# Altium schematic sheet BrauV2_Relay.SchDoc
size A3; PageSetup: Record=PageOptions|CenterHorizontal=True|CenterVertical=True|PrintScale=1.01|XCorrection=1.00|YCorrection=1.00|PrintKind=1|BorderSize=5000000|LeftOffset=0|BottomOffset=0|Orientation=2|PaperLength=1000|PaperWidth=1000|Scale=100|PaperSource=7|PrintQuality=-4|MediaType=1|DitherType=10|PaperKind=A3|PrintScaleMode=1
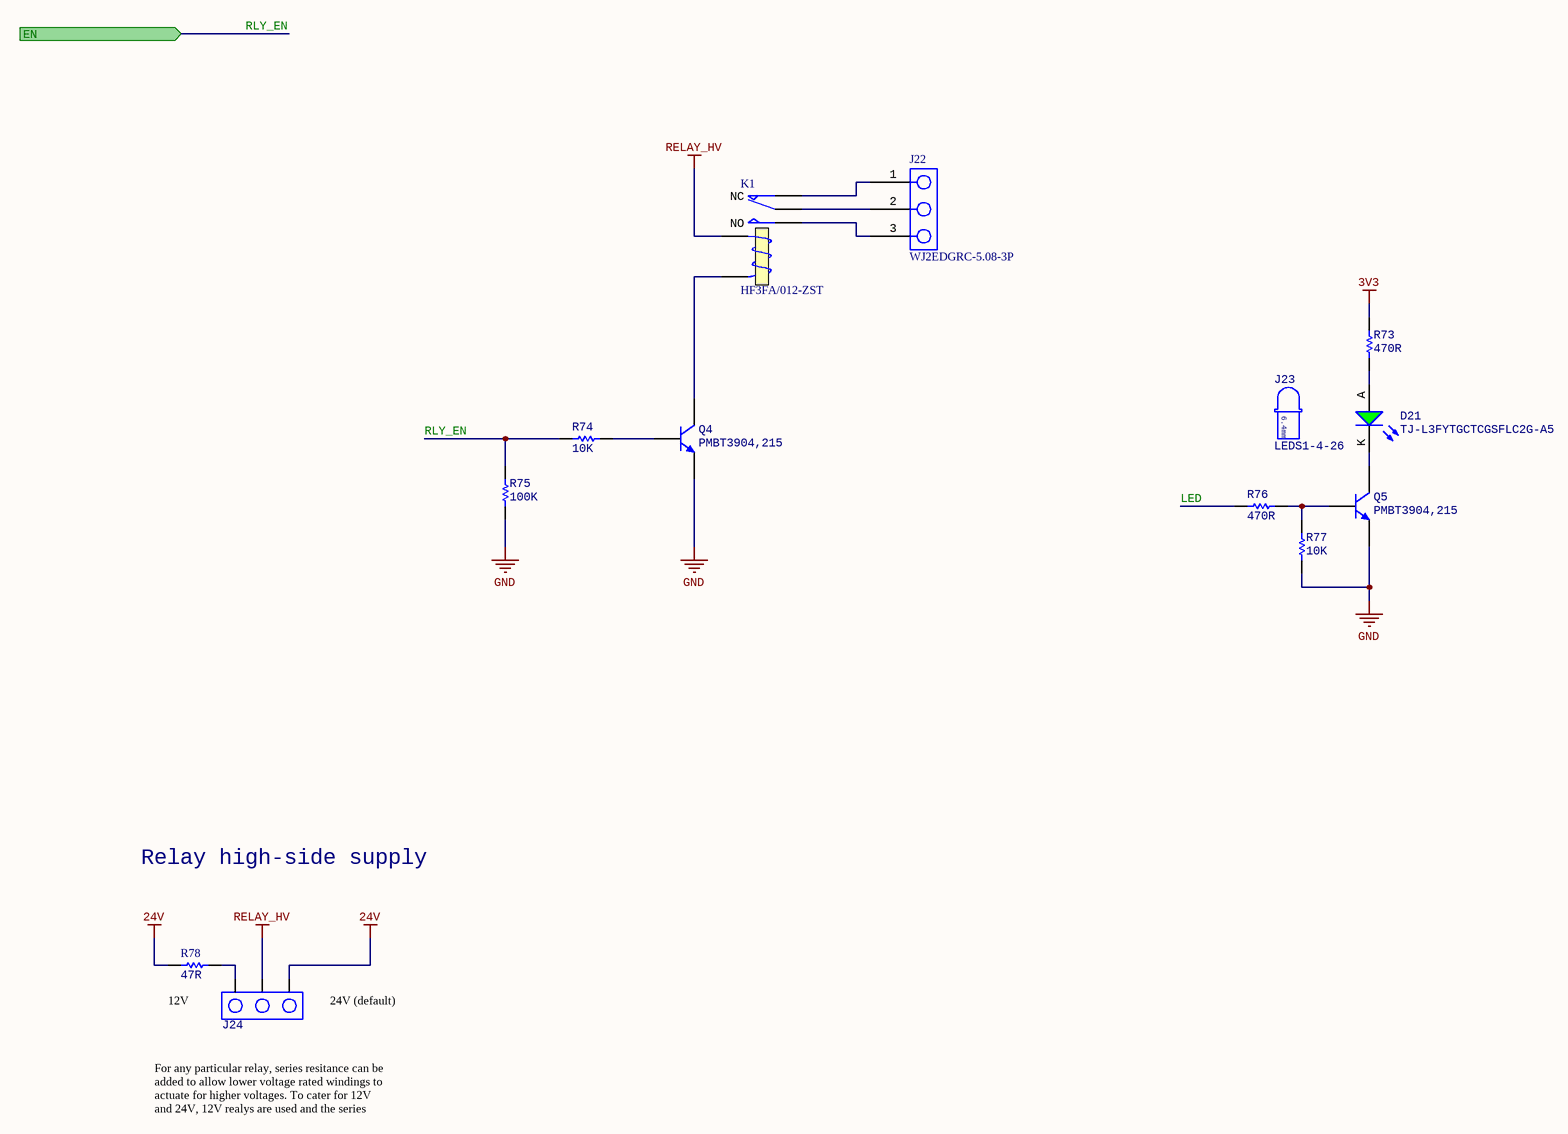
[diagram p0: BrauV2_Relay.SchDoc]

## Parts
D21  TJ-L3FYTGCTCGSFLC2G-A5  [LED_3MM_SPACED_6.4MM_GREEN]
J22  WJ2EDGRC-5.08-3P  [796638-3]
J23  LEDS1-4-26  [3MM_LED_SPACER_6.4MM]
J24  12251103CNG0S115001  [Header_3POS]  (value not drawn)
K1  HF3FA/012-ZST  [HF3FA/012-ZST]
Q4  PMBT3904,215  [SOT23-3]
Q5  PMBT3904,215  [SOT23-3]
R73  Resistance: 470R  [SMD_RES_2512(6432)_N]  (hidden comment: AC2512FK-07470RL)
R74  Resistance: 10K  [SMD_RES_0402(1005)_N]  (hidden comment: RC0402FR-0710KL)
R75  Resistance: 100K  [SMD_RES_0402(1005)_N]  (hidden comment: RC0402FR-07100KL)
R76  Resistance: 470R  [SMD_RES_2512(6432)_N]  (hidden comment: AC2512FK-07470RL)
R77  Resistance: 10K  [SMD_RES_0402(1005)_N]  (hidden comment: RC0402FR-0710KL)
R78  Resistance: 47R  [SMD_RES_2512(6432)_N]  (hidden comment: AC2512FK-0747RL)

## Ports
EN (in)

## Nets
3V3: R73.2
24V: J24.1 R78.1
GND: Q4.2(E) Q5.2(E) R75.2 R77.1
RELAY_HV: J24.2 K1.4(T1)
LED: R76.2
RLY_EN: R74.2 R75.1 ; port EN
NetD21_A: D21.A R73.1
NetD21_K: D21.K Q5.3(C)
NetJ22_1: J22.1 K1.2(NC)
NetJ22_2: J22.2 K1.1(COM)
NetJ22_3: J22.3 K1.3(NO)
NetJ24_3: J24.3 R78.2
NetK1_5: K1.5(T2) Q4.3(C)
NetQ4_1: Q4.1(B) R74.1
NetQ5_1: Q5.1(B) R76.1 R77.2

## Notes on the sheet
- Relay high-side supply
- 12V
- (near J24) 24V (default)
- For any particular relay, series resitance can be added to allow lower voltage rated windings to actuate for higher voltages. To cater for 12V and 24V, 12V realys are used and the series resitance of the coil is doubled using a resistor.
- REV
- Description
- ECN
- Date
- This document is property of DefendTex Pty. Ltd. and contains Intellectual Property owned by DefendTex and/or by Third Parties. Neither the whole nor any extract may be disclosed, reproduced, published, loaned, copied or distributed in any form, nor used for manufacturing or tendering purposes without prior authorisation from DefendTex
- Title:
- PCB:
- Revision:
- Drawn:
- Checked:
- Approved:
- Date:
- Size:
- A3
- Sheet
- of
- (in symbol LEDS1-4-26) 6.4mm

## Library data of the parts
D21 = TJ-L3FYTGCTCGSFLC2G-A5: LED 3mm Green 515nm~530nm 1.8V~3.6V Through Hole Light Emitting Diodes (LED) RoHS C330751
J22 = WJ2EDGRC-5.08-3P: Covered（4Sided） 3 1 0.200"（5.08mm） 3 P=5.08mm Pluggable System Terminal Block RoHS
J23 = LEDS1-4-26: 3mm LED spacer 6.4mm height
J24 = 3-way Jumper: Pin Header 3 1 right-angle，180degrees 2.54mm Through Hole,P=2.54mm Pin Header & Female Header RoHS
K1 = RELAY_SPDT: General Purpose Non Latching 12VDC SPDT Through Hole Relays RoHS
Q4 Q5 = PMBT3904,215: NPN 200mA 40V 250mW SOT-23(SOT-23-3) Transistors (NPN/PNP) RoHS
R73 R76 = 470R 2512 1% 1W: 470Ω ±1% 1W ±100ppm/℃ 2512 Chip Resistor - Surface Mount RoHS; Package: 2512; Tolerance: 1%; Power Rating: 1W
R74 R77 = 10K 0402 1% 1/16W: 10kΩ ±1% 1/16W ±100ppm/℃ 0402 Chip Resistor - Surface Mount RoHS; Package: 0402; Tolerance: 1%; Power Rating: 1/16W
R75 = 100K 0402 1% 1/16W: 100kΩ ±1% 1/16W ±100ppm/℃ 0402 Chip Resistor - Surface Mount RoHS; Package: 0402; Tolerance: 1%; Power Rating: 1/16W
R78 = 47R 2512 1% 1W: 47Ω ±1% 1W ±100ppm/℃ 2512 Chip Resistor - Surface Mount RoHS; Package: 2512; Tolerance: 1%; Power Rating: 1W